# EAGLE design air_cape_board_led (EAGLE 9.0.0)
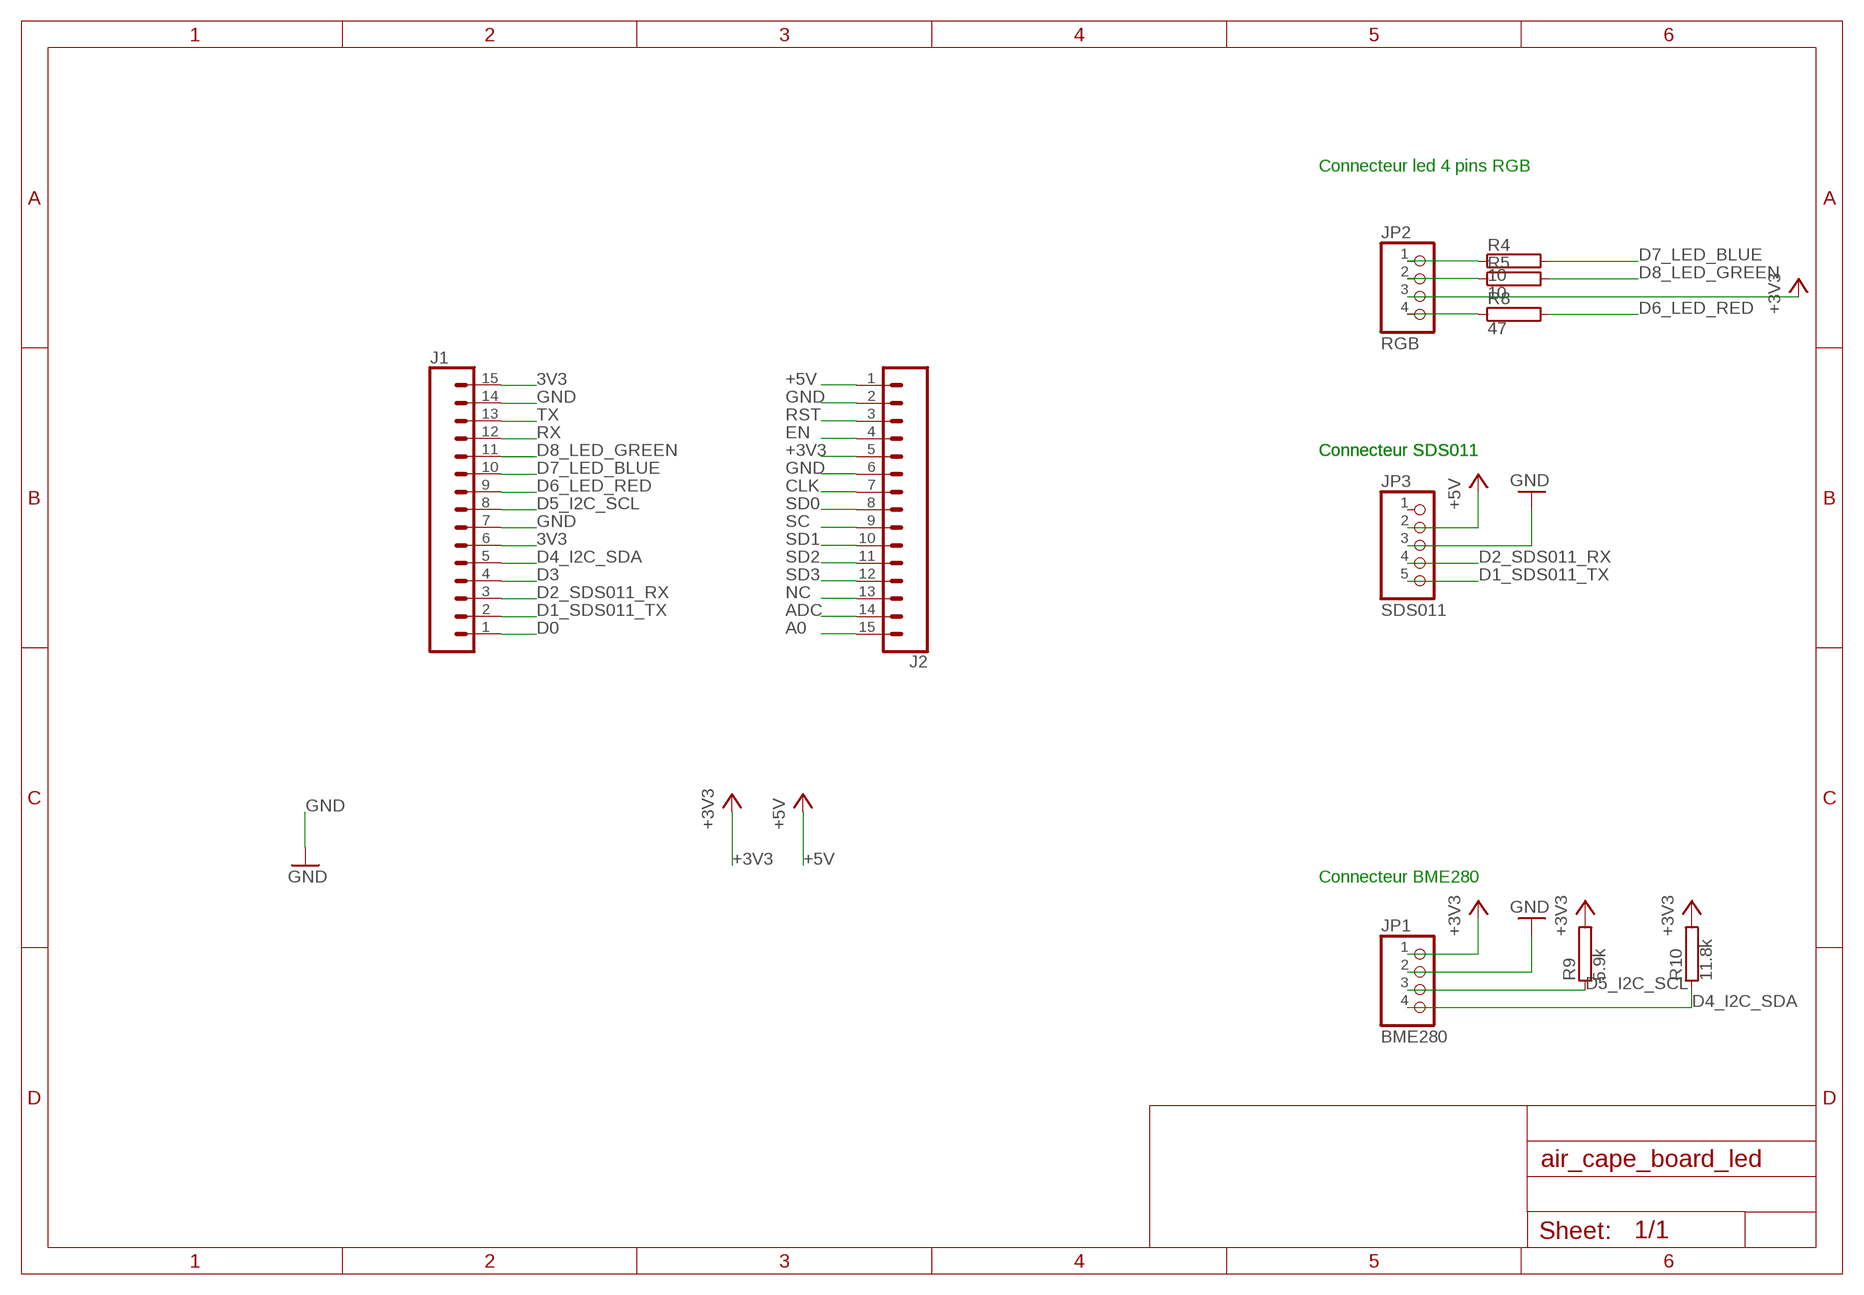
[diagram p0: schematic, sheet 1]

## Parts
J1  CONN_15  [1X15]
J2  CONN_15  [1X15]
JP1  BME280  PINHD-1X4  [1X04]
JP2  RGB  PINHD-1X4  [1X04]
JP3  SDS011  PINHD-1X5  [1X05]
R4  10  RRS1/4  [RS1/4]
R5  10  RRS1/4  [RS1/4]
R8  47  RRS1/4  [RS1/4]
R9  5.9k  RRS1/4  [RS1/4]
R10  11.8k  RRS1/4  [RS1/4]

## Nets
3V3: J1.6 J1.15
+3V3: J2.5 JP1.1 JP2.3 R9.2 R10.2
+5V: J2.1 JP3.2
A0: J2.15
ADC: J2.14
CLK: J2.7
D0: J1.1
D1_SDS011_TX: J1.2 JP3.5
D2_SDS011_RX: J1.3 JP3.4
D3: J1.4
D4_I2C_SDA: J1.5 JP1.4 R10.1
D5_I2C_SCL: J1.8 JP1.3 R9.1
D6_LED_RED: J1.9 R8.2
D7_LED_BLUE: J1.10 R4.2
D8_LED_GREEN: J1.11 R5.2
EN: J2.4
GND: J1.7 J1.14 J2.2 J2.6 JP1.2 JP3.3
N$1: JP2.4 R8.1
N$2: JP2.2 R5.1
N$3: JP2.1 R4.1
NC: J2.13
RST: J2.3
RX: J1.12
SC: J2.9
SD0: J2.8
SD1: J2.10
SD2: J2.11
SD3: J2.12
TX: J1.13
Unconnected: JP3.1

## Notes on the sheet
- Connecteur led 4 pins RGB
- Connecteur SDS011 | Connecteur SDS011
- Connecteur BME280

## Library data of the parts
J1 J2 = SparkFun-Connectors:CONN_15: Multi connection point. Often used as Generic Header-pin footprint for 0.1 inch spaced/style header connections On any of the 0.1 inch spaced packages, you can populate with these: Break Away Headers - Straight <https://www.sparkfun.com/products/116> (PRT-00116) Break Away Male Headers - Right Angle <https://www.sparkfun.com/products/553> (PRT-00553) Female Headers <https://www.sparkfun.com/products/115> (PRT-00115) Break Away Headers - Machine Pin <https://www.sparkfun.com/products/117> (PRT-00117) Break Away Female Headers - Swiss Machine Pin <https://www.sparkfun.com/products/743> (PRT-00743) For SCREWTERMINALS and SPRING TERMINALS visit here: Screw Terimnals on SparkFun.com <https://www.sparkfun.com/search/results?term=Screw+Terminals> (5mm/3.5mm/2.54mm spacing) This device is also useful as a general connection point to wire up your design to another part of your project. Our various solder wires solder well into these plated through hole pads. Hook-Up Wire - Assortment (Stranded, 22 AWG) <https://www.sparkfun.com/products/11375> (PRT-11375) Hook-Up Wire - Assortment (Solid Core, 22 AWG) <https://www.sparkfun.com/products/11367> (PRT-11367) View the entire wire category on our website here <https://www.sparkfun.com/categories/141> Special notes: Molex polarized connector foot print use with SKU : PRT-08231 with associated crimp pins and housings. 1MM SMD Version SKU: PRT-10208 NOTES ON THE VARIANTS LOCK and LOCK_LONGPADS... This footprint was designed to help hold the alignment of a through-hole component (i.e. 6-pin header) while soldering it into place. You may notice that each hole has been shifted either up or down by 0.005 of an inch from it's more standard position (which is a perfectly straight line). This slight alteration caused the pins (the squares in the middle) to touch the edges of the holes. Because they are alternating, it causes a "brace" to hold the component in place. 0.005 has proven to be the perfect amount of "off-center" position when using our standard breakaway headers. Although looks a little odd when you look at the bare footprint, once you have a header in there, the alteration is very hard to notice. Also,if you push a header all the way into place, it is covered up entirely on the bottom side.
JP1 JP2 = pinhead:PINHD-1X4: PIN HEADER
JP3 = pinhead:PINHD-1X5: PIN HEADER
R4 R5 R8-R10 = resistor-power:R: Power Resitor; MF: OHMITE; MPN: RRS1K0; OC_FARNELL: unknown; OC_NEWARK: 01F7661

## Board
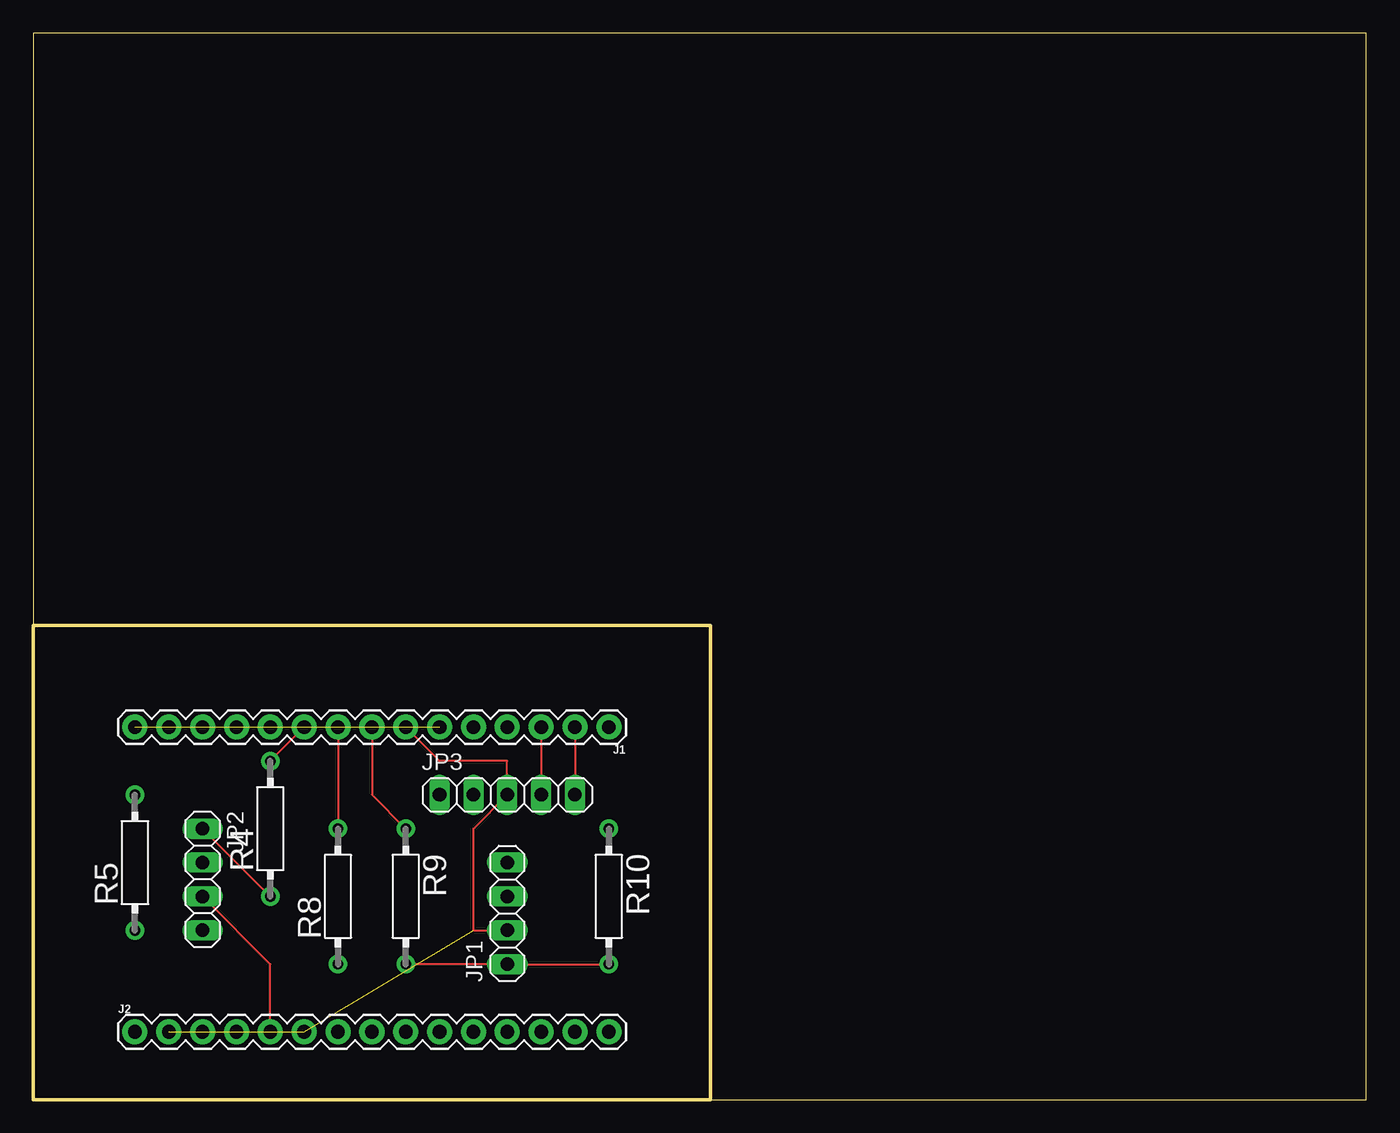
[diagram p1: board, top side]
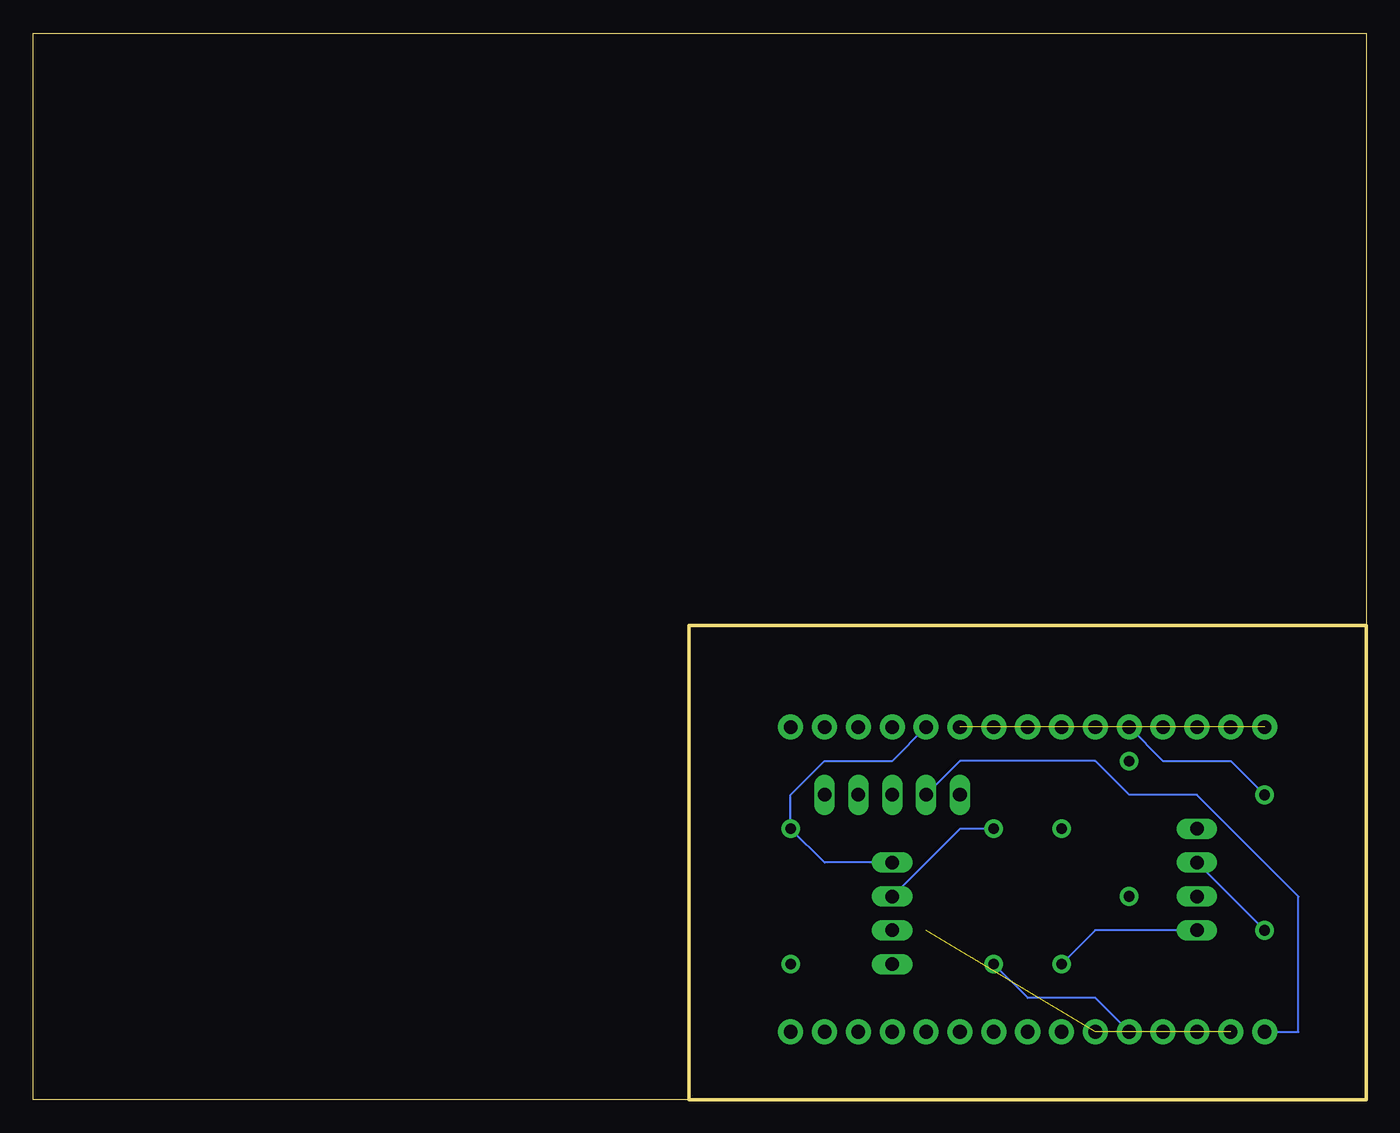
[diagram p2: board, bottom side, seen from below]

Size 100 x 80 mm. Coordinates in mm from the lower left corner, seen from the top.
Outline: 50.8,0 100,0 100,80 0,80 0,0
Outline: 0,0 0,35.56 50.8,35.56 50.8,0
Outline: 50.8,0 0,0
Copper layers (1*16): Top 0.035mm / dielectric 1.5mm / Bottom 0.035mm
Design rules "default *": minimum track width 6mil, minimum drill 0.35mm, track to track 2mil, track to pad 6mil, pad to pad 6mil, via to via 6mil, smd to smd 6mil, copper to edge 40mil, drill to drill 6mil, minimum pad ring 10mil, minimum via ring 8mil, stop-mask expansion 4mil, vias tented up to drill 0mil, thermal gap 10mil

### Footprints (pad centres in the part's own frame; a part is rotated, then mirrored left to right if it is on the bottom)
1X15 = drill 1.016 pad 1.88: 1 0,0; 2 2.54,0; 3 5.08,0; 4 7.62,0; 5 10.16,0; 6 12.7,0; 7 15.24,0; 8 17.78,0; 9 20.32,0; 10 22.86,0; 11 25.4,0; 12 27.94,0; 13 30.48,0; 14 33.02,0; 15 35.56,0
1X04 = drill 1.016 long: 1 -3.81,0; 2 -1.27,0; 3 1.27,0; 4 3.81,0
1X05 = drill 1.016 long: 1 -5.08,0; 2 -2.54,0; 3 0,0; 4 2.54,0; 5 5.08,0
RS1/4 = drill 0.8 pad 1.4: 1 -5.08,0; 2 5.08,0

### Placement (x,y rotation side)
J1  43.18,27.94 180 top
J2  7.62,5.08 0 top
JP1  35.56,13.97 90 top
JP2  12.7,16.51 270 top
JP3  35.56,22.86 0 top
R4  17.78,20.32 90 top
R5  7.62,17.78 90 top
R8  22.86,15.24 90 top
R9  27.94,15.24 270 top
R10  43.18,15.24 270 top

### Tracks (layer width: path | path; a pad name or v marks a point on that pad's centre or on a via)
3V3  (1 unrouted)
+3V3
  Top 0.152: R9.2 JP1.1 R10.2 | JP2.3 17.78,10.16 J2.5
  Bottom 0.152: R9.2 25.4,7.62 20.32,7.62 J2.5
+5V
  Bottom 0.152: JP3.2 30.48,25.4 20.32,25.4 17.78,22.86 12.7,22.86 5.08,15.24 5.08,5.08 J2.1
D1_SDS011_TX
  Top 0.152: J1.2 JP3.5
D2_SDS011_RX
  Top 0.152: J1.3 JP3.4
D4_I2C_SDA
  Bottom 0.152: JP1.4 40.64,17.78 R10.1 43.18,22.86 40.64,25.4 35.56,25.4 J1.5
D5_I2C_SCL
  Top 0.152: R9.1 25.4,22.86 J1.8
  Bottom 0.152: JP1.3 30.48,20.32 R9.1
D6_LED_RED
  Top 0.152: J1.9 R8.2
D7_LED_BLUE
  Top 0.152: J1.10 R4.2
D8_LED_GREEN
  Bottom 0.152: R5.2 10.16,25.4 15.24,25.4 J1.11
GND  (3 unrouted)
  Top 0.152: JP1.2 33.02,12.7 33.02,20.32 JP3.3 35.56,25.4 30.48,25.4 J1.7
N$1
  Bottom 0.152: R8.1 20.32,12.7 JP2.4
N$2
  Bottom 0.152: JP2.2 R5.1
N$3
  Top 0.152: JP2.1 R4.1